# EAGLE design Dual-suuply (EAGLE 9.6.2)
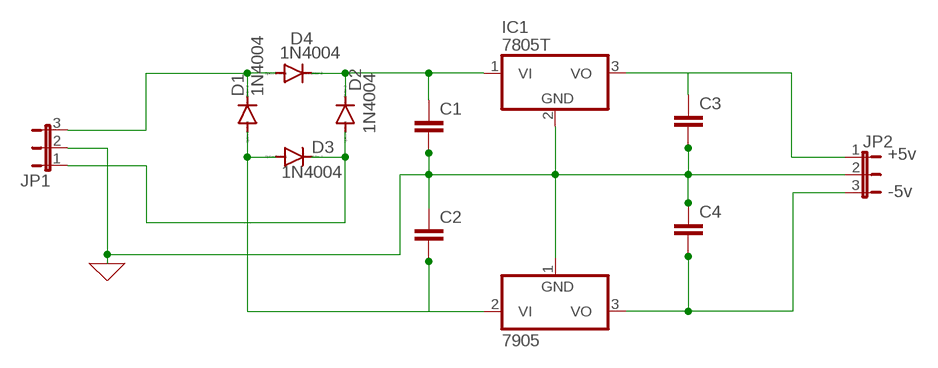
[diagram p0: schematic, sheet 1]

## Parts
7905  7906T  [TO220H]
C1  C-EU025-024X044  [C025-024X044]
C2  C-EU025-024X044  [C025-024X044]
C3  C-EU025-024X044  [C025-024X044]
C4  C-EU025-024X044  [C025-024X044]
D1  1N4004  [DO41-10]
D2  1N4004  [DO41-10]
D3  1N4004  [DO41-10]
D4  1N4004  [DO41-10]
IC1  7805T  [TO220H]
JP1  JP2E  [JP2]
JP2  JP2E  [JP2]

## Nets
0: 7905.1(GND) C1.2 C2.1 C3.2 C4.1 IC1.2(GND) JP1.2 JP2.2 ; supply symbol labelled GND
N$2: D1.C D4.A JP1.3
N$5: C1.1 D2.C D4.C IC1.1(VI)
N$6: C3.1 IC1.3(VO) JP2.1
N$7: D2.A D3.C JP1.1
N$10: 7905.3(VO) C4.2 JP2.3
N$11: 7905.2(VI) C2.2 D1.A D3.A

## Notes on the sheet
- +5v
- -5v

## Library data of the parts
7905 = linear:79*: Negative VOLTAGE REGULATOR
C1-C4 = rcl:C-EU: CAPACITOR, European symbol; SPICEPREFIX: C
D1-D4 = diode:1N4004: DIODE general purpose rectifier, 1 A
IC1 = linear:78*: Positive VOLTAGE REGULATOR Source: http://cache.national.com/ds/LM/LM78L05.pdf http://www.fairchildsemi.com/ds/LM/LM7805.pdf
JP1 JP2 = jumper:JP2E: JUMPER

## Board
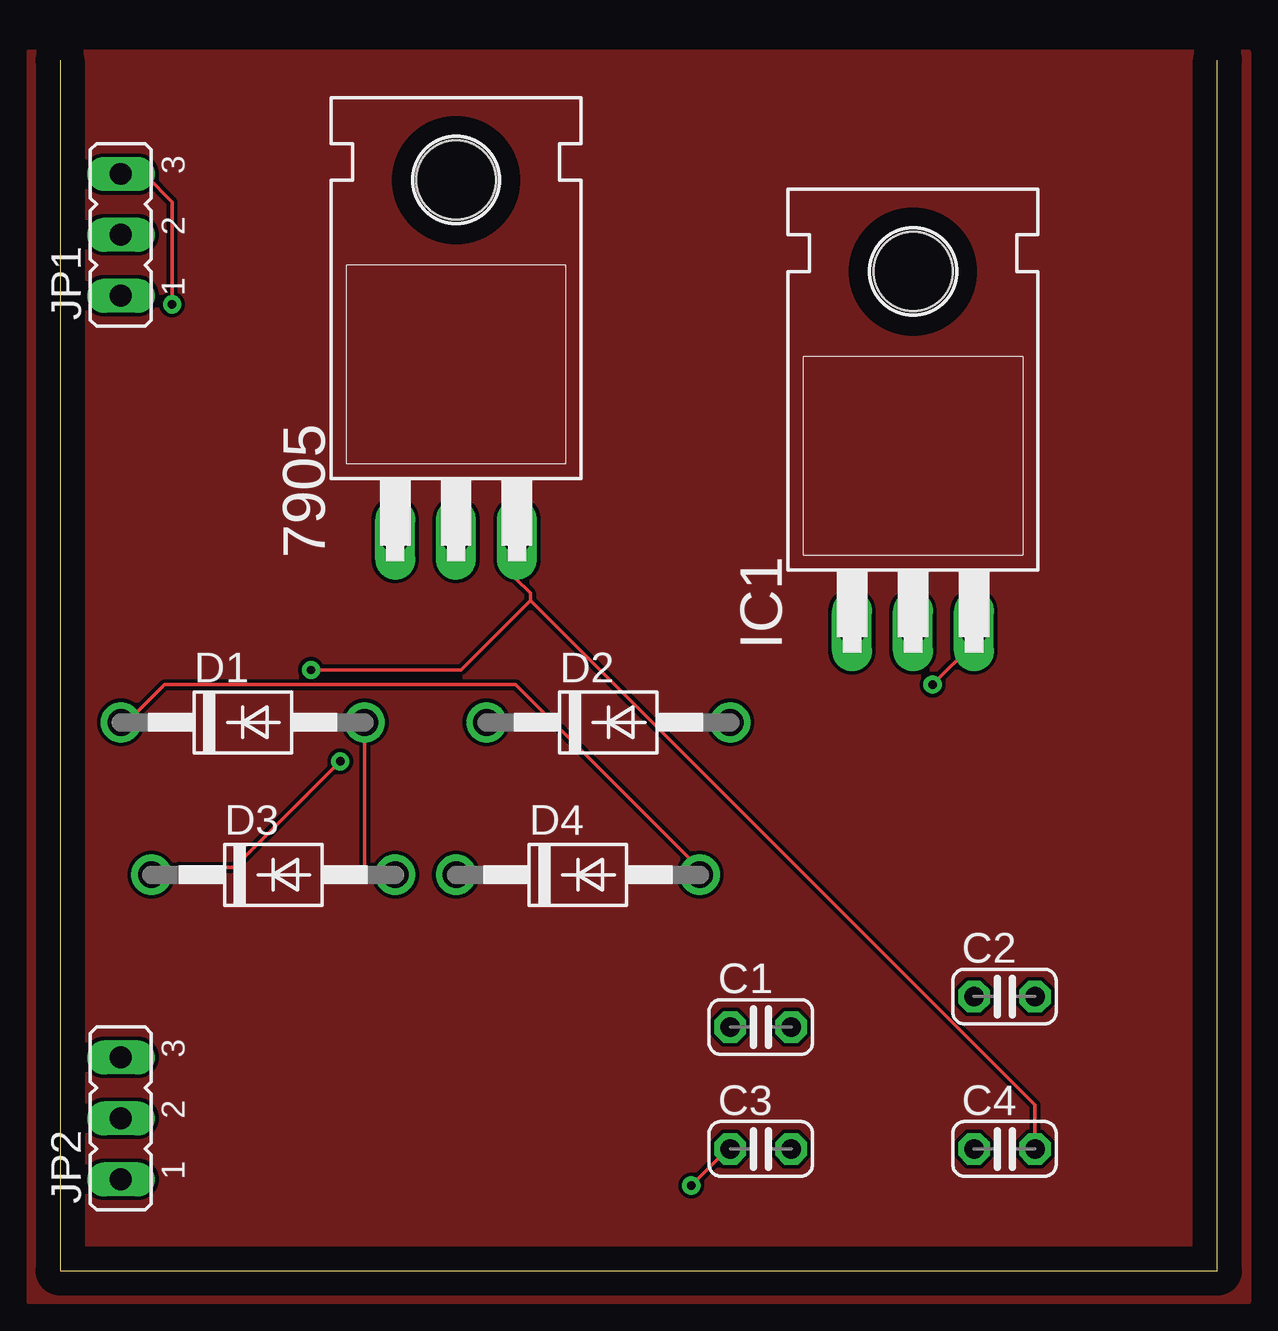
[diagram p1: board, top side]
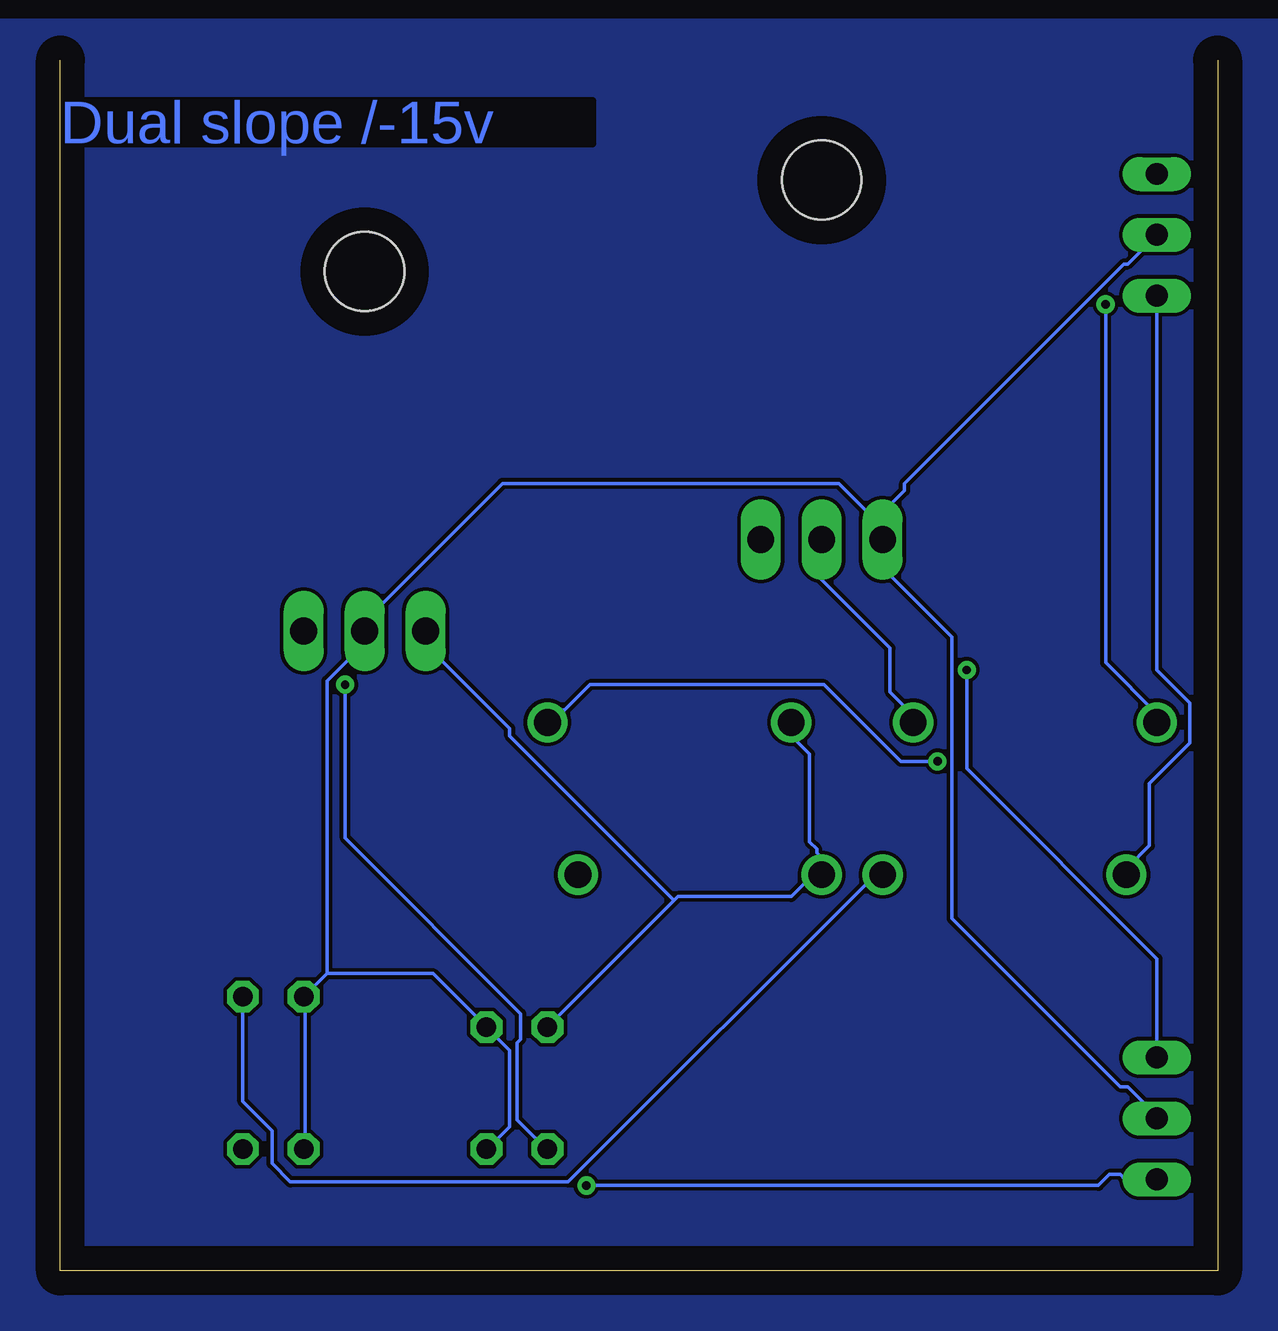
[diagram p2: board, bottom side, seen from below]

Size 48.24 x 50.47 mm. Coordinates in mm from the lower left corner, seen from the top.
Outline: 48.24,50.47 48.24,0 0,0 0,50.47
Copper layers (1*16): Top 0.035mm / dielectric 1.5mm / Bottom 0.035mm
Design rules "default": minimum track width 6mil, minimum drill 0.35mm, track to track 6mil, track to pad 6mil, pad to pad 6mil, via to via 6mil, smd to smd 6mil, copper to edge 40mil, drill to drill 6mil, minimum pad ring 10mil, minimum via ring 8mil, stop-mask expansion 4mil, vias tented up to drill 0mil, thermal gap 10mil

### Footprints (pad centres in the part's own frame; a part is rotated, then mirrored left to right if it is on the bottom)
TO220H = drill 1.118 long: 1 -2.54,-10.16; 2 0,-10.16; 3 2.54,-10.16 | hole 3.302: 0,4.826
C025-024X044 = drill 0.813 octagon: 1 -1.27,0; 2 1.27,0
DO41-10 = drill 1.118: A 5.08,0; C -5.08,0
JP2 = drill 0.914 long: 1 -2.54,0; 2 0,0; 3 2.54,0

### Placement (x,y rotation side)
7905  16.51,40.64 0 top
C1  29.21,10.16 0 top
C2  39.37,11.43 0 top
C3  29.21,5.08 0 top
C4  39.37,5.08 0 top
D1  7.62,22.86 0 top
D2  22.86,22.86 0 top
D3  8.89,16.51 0 top
D4  21.59,16.51 0 top
IC1  35.56,36.83 0 top
JP1  2.54,43.18 90 top
JP2  2.54,6.35 90 top

### Tracks (layer width: path | path; a pad name or v marks a point on that pad's centre or on a via)
0
  Bottom 0.152: C3.2 30.43,5.08 29.52,5.99 29.52,9.2 C1.2 32.71,12.4 37.13,12.4 | C4.1 38.05,5.08 38.05,11.33 C2.1 37.13,12.4 | 37.13,12.4 37.13,24.59 35.61,26.11 35.61,26.57 IC1.2 35.46,26.72 35.46,27.18 29.82,32.82 15.8,32.82 14.58,31.6 13.97,31.6 | 7905.1 13.97,29.31 11.07,26.42 11.07,14.68 4.06,7.67 3.76,7.67 2.54,6.45 JP2.2 | JP1.2 3.76,41.96 3.91,41.96 13.06,32.82 13.06,32.51 13.97,31.6 | 7905.1 13.97,31.6 | 13.97,30.53 7905.1
GND
  pour Bottom: -2.54,52.07 50.8,52.07 50.8,-2.54 -2.54,-2.54
N$1
  pour Top: 0,50.8 49.53,50.8 49.53,-1.27 -1.27,-1.27 -1.27,50.8
N$2  (via drill 0.35)
  Top 0.152: v4.67,40.28 4.67,44.55 3.61,45.62 2.54,45.62 JP1.3 | D4.A 26.62,16.51 26.62,16.81 19,24.44 4.37,24.44 2.84,22.91 2.54,22.91 D1.C
  Bottom 0.152: v4.67,40.28 4.67,25.35 2.54,23.22 D1.C
N$5
  Bottom 0.152: 22.66,15.44 22.5,15.6 17.78,15.6 16.87,16.51 16.56,16.51 | 22.66,15.44 C1.1 | D2.C 17.78,22.3 17.02,21.54 17.02,17.88 16.71,17.58 16.71,17.42 16.56,17.27 16.56,16.51 | 16.56,16.51 D4.C | IC1.1 33.02,26.11 29.52,22.61 29.52,22.3 22.66,15.44
N$6  (via drill 0.35)
  Top 0.152: v26.31,3.56 27.84,5.08 C3.1 | v36.37,24.44 38.05,26.11 38.05,26.57 IC1.3
  Bottom 0.152: v26.31,3.56 4.98,3.56 4.52,4.01 4.06,4.01 3.91,3.86 2.54,3.86 JP2.1 | v36.37,24.44 36.37,18.03 29.06,10.72 29.06,9.65 29.21,9.5 29.21,6.3 27.99,5.08 C3.1
N$7  (via drill 0.35)
  Top 0.152: v11.68,21.23 7.26,16.81 4.98,16.81 4.83,16.66 4.06,16.66 3.91,16.51 D3.C
  Bottom 0.152: JP1.1 2.54,25.04 1.17,23.67 1.17,22 2.84,20.32 2.84,17.73 3.76,16.81 3.76,16.51 D3.C | v11.68,21.23 13.21,21.23 16.41,24.44 26.16,24.44 27.23,23.37 27.38,23.37 27.84,22.91 D2.A
N$10  (via drill 0.35)
  Top 0.152: C4.2 40.64,6.91 19.61,27.94 | 19.61,27.94 19.61,28.24 19,28.85 19,30.38 7905.3 | v10.46,25.04 16.71,25.04 19.61,27.94
  Bottom 0.152: JP2.3 2.54,13.01 10.46,20.93 v10.46,25.04
N$11
  Top 0.152: D1.A 12.7,16.51 D3.A
  Bottom 0.152: C2.2 40.64,7.06 39.42,5.84 39.42,4.47 38.66,3.71 27.08,3.71 14.27,16.51 D3.A | 7905.2 16.56,30.38 16.56,28.85 13.66,25.96 13.66,24.13 12.75,23.22 12.75,22.91 D1.A

### Text on the board
Bottom: Dual slope /-15v